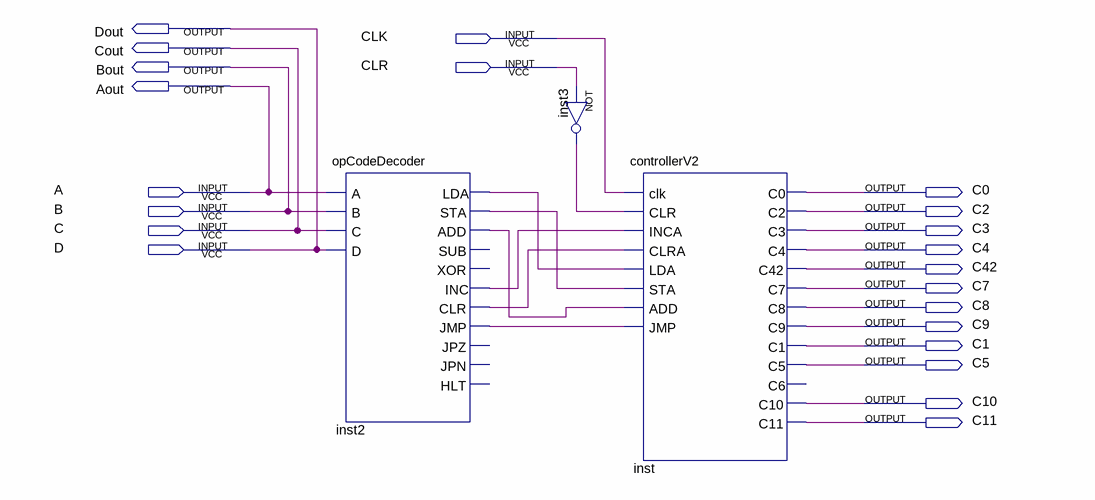
[diagram p0: schematic sheet]
// Quartus schematic partBTest.bdf as structural Verilog: 3 symbols, 22 pins
module partBTest (
  input  CLK,
  input  CLR,
  input  A,
  input  B,
  input  C,
  input  D,
  output Dout,
  output Cout,
  output Bout,
  output Aout,
  output C0,
  output C2,
  output C3,
  output C4,
  output C42,
  output C7,
  output C8,
  output C9,
  output C1,
  output C5,
  output C10,
  output C11
);

  wire inst2_add, inst2_clr, inst2_inc, inst2_jmp, inst2_lda, inst2_sta, inst3_out;

  opCodeDecoder inst2 (
    .A(A), .B(B), .C(C), .D(D), .LDA(inst2_lda), .STA(inst2_sta), .ADD(inst2_add), .INC(inst2_inc),
    .CLR(inst2_clr), .JMP(inst2_jmp));  // open: SUB, XOR, JPZ, JPN, HLT
  not inst3 (inst3_out, CLR);
  controllerV2 inst (
    .clk(CLK), .CLR(inst3_out), .INCA(inst2_inc), .CLRA(inst2_clr), .LDA(inst2_lda), .STA(inst2_sta),
    .ADD(inst2_add), .JMP(inst2_jmp), .C0(C0), .C2(C2), .C3(C3), .C4(C4), .C42(C42), .C7(C7), .C8(C8),
    .C9(C9), .C1(C1), .C5(C5), .C10(C10), .C11(C11));  // open: C6

  assign Aout = A;
  assign Bout = B;
  assign Cout = C;
  assign Dout = D;
endmodule
